# Altium project carte_ecureuil2026.PrjPcb
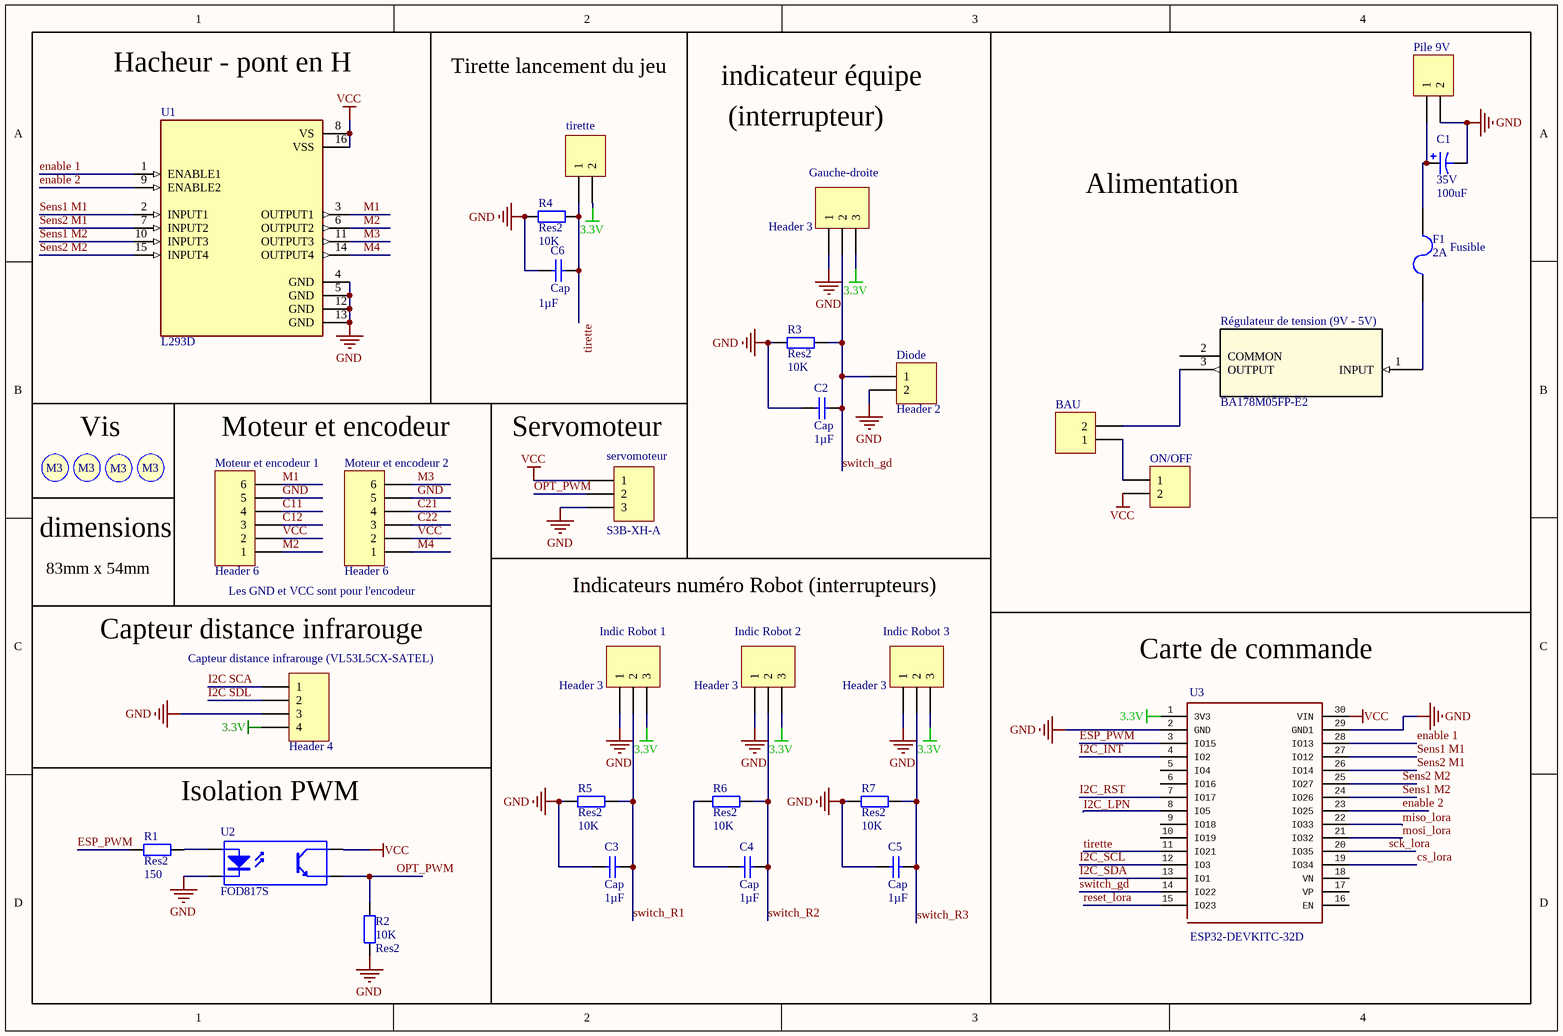
[diagram p0: carte_ecureuil2026.SchDoc]
1 sheet, 35 parts. Net scope: global (net labels, ports and power ports of the same name join across sheets).
Board file: carte_ecureuil2026.PcbDoc

## Sheet carte_ecureuil2026.SchDoc
size A4; SheetNumber: 1; SheetTotal: 1

### Parts
BAU  Bouton d'Arrêt d'Urgence  [S2B-XH-A]  (value not drawn)
C1  35V  value 100uF  [Condensateur]
C2  Cap  value 1µF  [Capacitor 1206]
C3  Cap  value 1µF  [Capacitor 1206]
C4  Cap  value 1µF  [Capacitor 1206]
C5  Cap  value 1µF  [Capacitor 1206]
C6  Cap  value 1µF  [Capacitor 1206]
Capteur_distance_infrarouge_(VL53L5CX-SATEL)  Header 4  [HDR1X4]
Diode  Header 2  [HDR1X2]
F1  2A  [Fuse]
Gauche-droite  Header 3  [HDR1X3]
Indic_Robot_1  Header 3  [HDR1X3]
Indic_Robot_2  Header 3  [HDR1X3]
Indic_Robot_3  Header 3  [HDR1X3]
Moteur_et_encodeur_1  Header 6  [HDR1X6]
Moteur_et_encodeur_2  Header 6  [HDR1X6]
ON/OFF  (no value)  [S2B-XH-A]
Pile_9V  (no value)  [S2B-XH-A]
R1  Res2  value 150  [Resistor 1206]
R2  Res2  value 10K  [Resistor 1206]
R3  Res2  value 10K  [Resistor 1206]
R4  Res2  value 10K  [Resistor 1206]
R5  Res2  value 10K  [Resistor 1206]
R6  Res2  value 10K  [Resistor 1206]
R7  Res2  value 10K  [Resistor 1206]
Régulateur_de_tension_(9V_-_5V)  BA178M05FP-E2  [TOT252-3_BA178_ROM]
S1  Screw M3  [Screw M3]  (value not drawn)
S2  Screw M3  [Screw M3]  (value not drawn)
S3  Screw M3  [Screw M3]  (value not drawn)
S4  Screw M3  [Screw M3]  (value not drawn)
servomoteur  S3B-XH-A  [S3B-XH-A]
tirette  (no value)  [S2B-XH-A]
U1  L293D  [DIP880W50P254L2000H510Q16]
U2  FOD817S  [SOP254P1016X385-4N]
U3  ESP32-DEVKITC-32D  [MODULE_ESP32-DEVKITV1]

### Blocks framed on the sheet
Hacheur - pont en H: U1
Tirette lancement du jeu: C6 R4 tirette
Alimentation: BAU C1 F1 ON/OFF Pile_9V Régulateur_de_tension_(9V_-_5V)
Vis: S1-S4
Moteur et encodeur: Moteur_et_encodeur_1 Moteur_et_encodeur_2
Servomoteur: servomoteur
Indicateurs numéro Robot (interrupteurs): C3-C5 Indic_Robot_1-Indic_Robot_3 R5-R7
Capteur distance infrarouge: Capteur_distance_infrarouge_(VL53L5CX-SATEL)
Carte de commande: U3
Isolation PWM: R1 R2 U2

### Nets
3.3V: Capteur_distance_infrarouge_(VL53L5CX-SATEL).4 Gauche-droite.3 Indic_Robot_1.3 Indic_Robot_2.3 Indic_Robot_3.3 tirette.2 U3.1(3V3)
GND: C1.2 C2.1 C3.1 C5.1 C6.1 Capteur_distance_infrarouge_(VL53L5CX-SATEL).3 Diode.2 Gauche-droite.1 Indic_Robot_1.1 Indic_Robot_2.1 Indic_Robot_3.1 Moteur_et_encodeur_1.5 Moteur_et_encodeur_2.5 Pile_9V.2 R2.1 R3.1 R4.1 R5.1 R7.1 servomoteur.3 U1.4(GND) U1.5(GND) U1.12(GND) U1.13(GND) U2.2(K) U3.2(GND) U3.29(GND1)
VCC: Moteur_et_encodeur_1.2 Moteur_et_encodeur_2.2 ON/OFF.2 servomoteur.1 U1.8(VS) U1.16(VSS) U2.4(C) U3.30(VIN)
C11: Moteur_et_encodeur_1.4
C12: Moteur_et_encodeur_1.3
C21: Moteur_et_encodeur_2.4
C22: Moteur_et_encodeur_2.3
cs_lora: U3.19(IO34)
enable 1: U1.1(ENABLE1) U3.28(IO13)
enable 2: U1.9(ENABLE2) U3.23(IO25)
ESP_PWM: R1.1 U3.3(IO15)
I2C SCA: Capteur_distance_infrarouge_(VL53L5CX-SATEL).1
I2C SDL: Capteur_distance_infrarouge_(VL53L5CX-SATEL).2
I2C_INT: U3.4(IO2)
I2C_LPN: U3.8(IO5)
I2C_RST: U3.7(IO17)
I2C_SCL: U3.12(IO3)
I2C_SDA: U3.13(IO1)
M1: Moteur_et_encodeur_1.6 U1.3(OUTPUT1)
M2: Moteur_et_encodeur_1.1 U1.6(OUTPUT2)
M3: Moteur_et_encodeur_2.6 U1.11(OUTPUT3)
M4: Moteur_et_encodeur_2.1 U1.14(OUTPUT4)
miso_lora: U3.22(IO33)
mosi_lora: U3.21(IO32)
OPT_PWM: R2.2 servomoteur.2 U2.3(E)
reset_lora: U3.15(IO23)
sck_lora: U3.20(IO35)
Sens1 M1: U1.2(INPUT1) U3.27(IO12)
Sens1 M2: U1.10(INPUT3) U3.24(IO26)
Sens2 M1: U1.7(INPUT2) U3.26(IO14)
Sens2 M2: U1.15(INPUT4) U3.25(IO27)
switch_gd: C2.2 Diode.1 Gauche-droite.2 R3.2 U3.14(IO22)
switch_R1: C3.2 Indic_Robot_1.2 R5.2
switch_R2: C4.2 Indic_Robot_2.2 R6.2
switch_R3: C5.2 Indic_Robot_3.2 R7.2
tirette: C6.2 R4.2 tirette.1 U3.11(IO21)
NetBAU_1: BAU.1 ON/OFF.1
NetBAU_2: BAU.2 Régulateur_de_tension_(9V_-_5V).3(OUTPUT)
NetC1_1: C1.1 F1.2 Pile_9V.1
NetC4_1: C4.1 R6.1
NetF1_1: F1.1 Régulateur_de_tension_(9V_-_5V).1(INPUT)
NetR1_2: R1.2 U2.1(A)

Not connected (* = marked no-connect by the designer): Régulateur_de_tension_(9V_-_5V) 2(COMMON); U3 5(IO4) 6(IO16) 9(IO18) 10(IO19) 16(EN) 17(VP) 18(VN)

### Notes on the sheet
- indicateur équipe
- (interrupteur)
- (near F1) Fusible
- dimensions
- 83mm x 54mm
- Les GND et VCC sont pour l'encodeur
- (in symbol Screw M3) M3

### Library data of the parts
BAU ON/OFF Pile_9V tirette = Header 2H: Header, 2-Pin, Right Angle; LatestRevisionDate: 17-Jul-2002; LatestRevisionNote: Re-released for DXP Platform.; Publisher: Altium Limited
C1 = Cap Pol1: Polarized Capacitor (Radial); Published: 8-Jun-2000; LatestRevisionDate: 17-Jul-2002; LatestRevisionNote: Re-released for DXP Platform.; PackageReference: RB7.6-15; Publisher: Altium Limited; PackageDescription: Polarized Capacitor (Radial); 2 Leads
C2-C6 = Cap: Capacitor; Published: 8-Jun-2000; LatestRevisionDate: 17-Jul-2002; LatestRevisionNote: Re-released for DXP Platform.; PackageReference: RAD-0.3; Publisher: Altium Limited; PackageDescription: Radial Cap, Thru-Hole; 2 Leads; 0.3 in Pin Spacing
Capteur_distance_infrarouge_(VL53L5CX-SATEL) = Header 4: Header, 4-Pin; LatestRevisionDate: 17-Jul-2002; LatestRevisionNote: Re-released for DXP Platform.; Publisher: Altium Limited
Diode = Header 2: Header, 2-Pin; LatestRevisionDate: 17-Jul-2002; LatestRevisionNote: Re-released for DXP Platform.; Publisher: Altium Limited
F1 = Fuse 2: Fuse; Published: 8-Jun-2000; LatestRevisionDate: 17-Jul-2002; LatestRevisionNote: Re-released for DXP Platform.; PackageReference: PIN-W2/E2.8; Publisher: Altium Limited; PackageDescription: Thru-Hole; 2 Leads
Gauche-droite Indic_Robot_1-Indic_Robot_3 = Header 3: Header, 3-Pin; LatestRevisionDate: 17-Jul-2002; LatestRevisionNote: Re-released for DXP Platform.; Publisher: Altium Limited
Moteur_et_encodeur_1 Moteur_et_encodeur_2 = Header 6: Header, 6-Pin; LatestRevisionDate: 17-Jul-2002; LatestRevisionNote: Re-released for DXP Platform.; Publisher: Altium Limited
R1-R7 = Res2: Resistor; Published: 8-Jun-2000; LatestRevisionDate: 17-Jul-2002; LatestRevisionNote: Re-released for DXP Platform.; PackageReference: AXIAL-0.4; Publisher: Altium Limited; PackageDescription: Axial Device, Thru-Hole; 2 Leads; 0.4 in Pin Spacing
Régulateur_de_tension_(9V_-_5V) = BA178M05FP-E2: No Description Available; Manufacturer_Name: ROHM Semiconductor; Copyright: Copyright (C) 2025 Ultra Librarian. All rights reserved.; Manufacturer_Part_Number: BA178M05FP-E2; RefDes: RefDes; Type: Type
servomoteur = Header 3H: Header, 3-Pin, Right Angle; LatestRevisionDate: 17-Jul-2002; LatestRevisionNote: Re-released for DXP Platform.; Publisher: Altium Limited
U1 = L293D: Bipolar Motor Driver - Parallel 16-PowerDIP; MF: STMicroelectronics; MP: L293D; Package: DIP-16 STMicroelectronics; SnapEDA_Link: https://www.snapeda.com/parts/L293D/STMicroelectronics/view-part/?ref=snap; Purchase-URL: https://pricing.snapeda.com/search/part/L293D/?ref=eda; Check_prices: https://www.snapeda.com/parts/L293D/STMicroelectronics/view-part/?ref=eda; Availability: In Stock; Value: *; Price: None
U2 = Optoisolator1: 4-Pin Phototransistor Optocoupler; Published: 24-Mar-1999; LatestRevisionDate: 04-Mar-2005; LatestRevisionNote: Sch pins 3 & 4 Swapped.; DatasheetVersion: Nov-2003; PackageReference: DIP-4; Publisher: Altium Limited
U3 = ESP32-DEVKITC-32D: Eval Board For Esp-Wroom-32; MF: Espressif Systems; Availability: Unavailable; Package: None; SnapEDA_Link: https://www.snapeda.com/parts/ESP32-DEVKITC-32D/Espressif%20Systems/view-part/?ref=snap; MP: ESP32-DEVKITC-32D; Price: None; Value: *